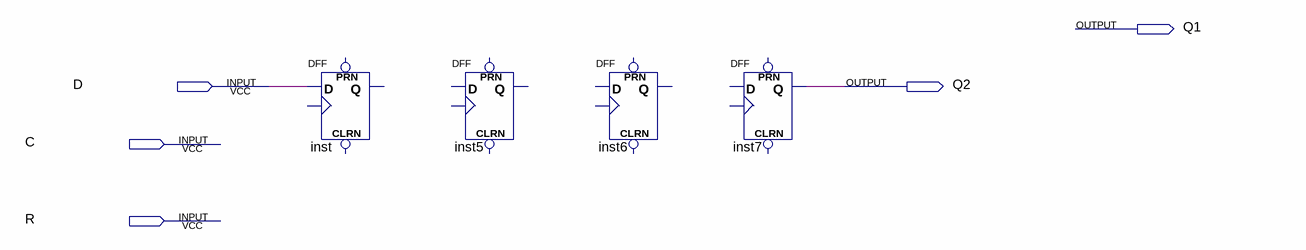
[diagram p0: schematic sheet]
// Quartus schematic lab_7_1.bdf as structural Verilog: 4 symbols, 5 pins
module lab_7_1 (
  input  D,
  input  C,
  input  R,
  output Q1,
  output Q2
);

  DFF inst (.D(D));  // open: CLRN, CLK, PRN, Q
  DFF inst5 ();  // open: CLRN, CLK, D, PRN, Q
  DFF inst6 ();  // open: CLRN, CLK, D, PRN, Q
  DFF inst7 (.Q(Q2));  // open: CLRN, CLK, D, PRN
endmodule
